# Altium schematic sheet GSM.SchDoc
size A2; SheetNumber: 3; SheetTotal: 8
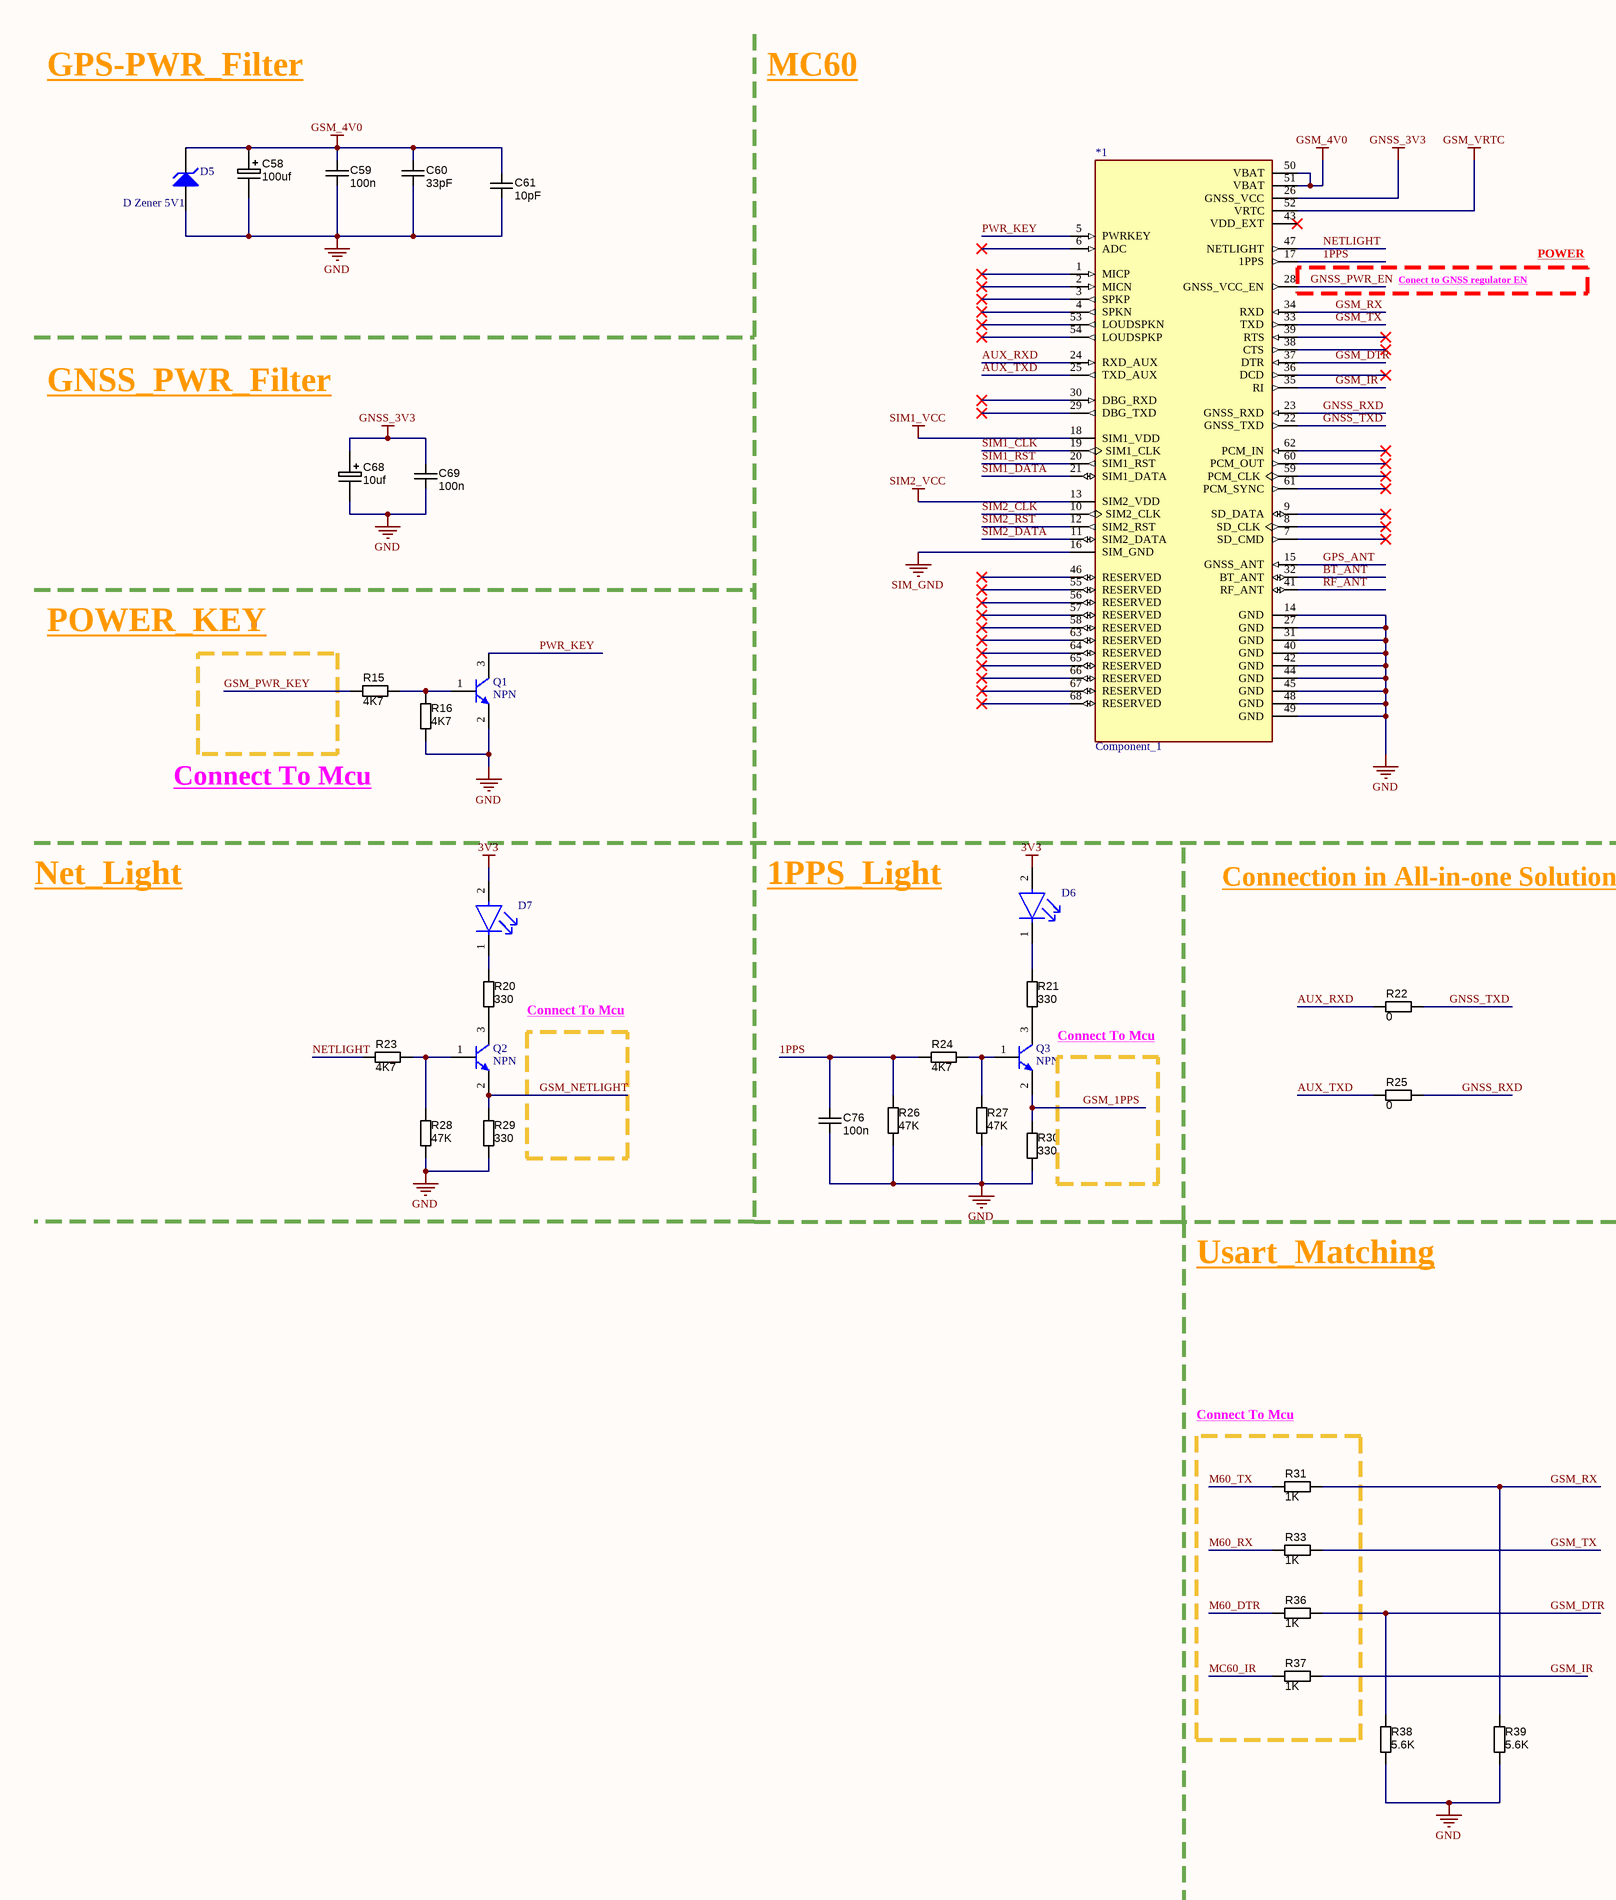
[diagram p0: GSM.SchDoc, left]
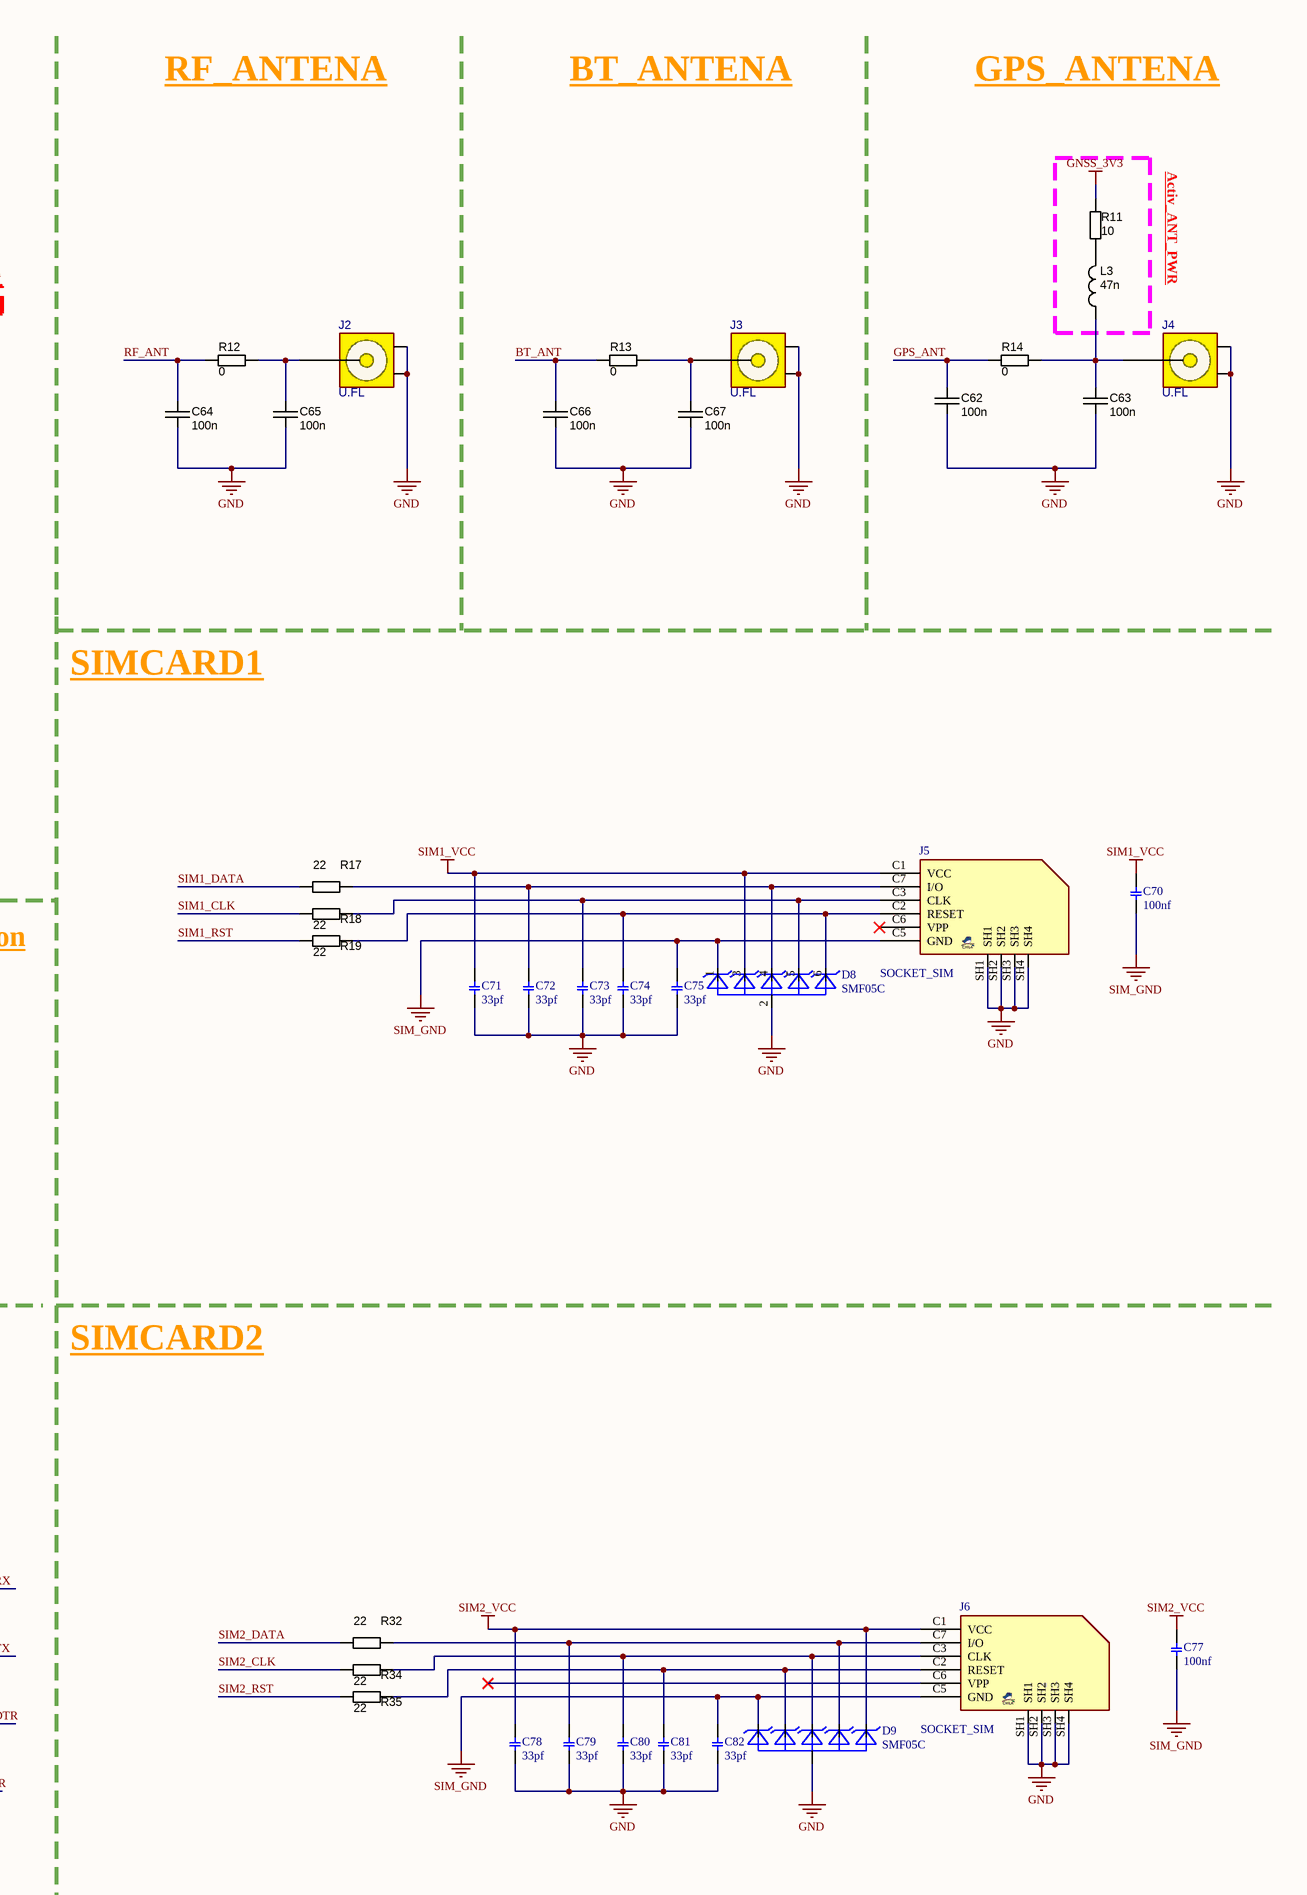
[diagram p1: GSM.SchDoc, right]

## Parts
*1  Component_1  [PCBComponent_1]
C58  value 100uf  [C_TN_3528]
C59  value 100n  [CAPC1608X90N]  (hidden comment: approved sub OK)
C60  value 33pF  [CAPC1608X90N]  (hidden comment: approved sub OK)
C61  value 10pF  [CAPC1608X90N]  (hidden comment: approved sub OK)
C62  value 100n  [C0402]  (hidden comment: approved sub OK)
C63  value 100n  [C0402]  (hidden comment: approved sub OK)
C64  value 100n  [C0402]  (hidden comment: approved sub OK)
C65  value 100n  [C0402]  (hidden comment: approved sub OK)
C66  value 100n  [C0402]  (hidden comment: approved sub OK)
C67  value 100n  [C0402]  (hidden comment: approved sub OK)
C68  value 10uf  [C_TN_3528]
C69  value 100n  [CAPC1608X90N]  (hidden comment: approved sub OK)
C70  value 100nf  [0603]  (hidden comment: Capacitor C SMD 0603)
C71  value 33pf  [0603]  (hidden comment: Capacitor C SMD 0603)
C72  value 33pf  [0603]  (hidden comment: Capacitor C SMD 0603)
C73  value 33pf  [0603]  (hidden comment: Capacitor C SMD 0603)
C74  value 33pf  [0603]  (hidden comment: Capacitor C SMD 0603)
C75  value 33pf  [0603]  (hidden comment: Capacitor C SMD 0603)
C76  value 100n  [CAPC1608X90N]  (hidden comment: approved sub OK)
C77  value 100nf  [0603]  (hidden comment: Capacitor C SMD 0603)
C78  value 33pf  [0603]  (hidden comment: Capacitor C SMD 0603)
C79  value 33pf  [0603]  (hidden comment: Capacitor C SMD 0603)
C80  value 33pf  [0603]  (hidden comment: Capacitor C SMD 0603)
C81  value 33pf  [0603]  (hidden comment: Capacitor C SMD 0603)
C82  value 33pf  [0603]  (hidden comment: Capacitor C SMD 0603)
D5  D Zener 5V1  [DIODE-0.7]
D6  LTST-C191TBKT  [FP-LTST-C191TBKT-MFG]  (value not drawn)
D7  LTST-C191TBKT  [FP-LTST-C191TBKT-MFG]  (value not drawn)
D8  SMF05C  [SC70-6]
D9  SMF05C  [SC70-6]
J2  U.FL  [UFL]
J3  U.FL  [UFL]
J4  U.FL  [UFL]
J5  SOCKET_SIM  [SIM_MICRO_GCT]
J6  SOCKET_SIM  [SIM_MICRO_GCT]
L3  47n  [L0603]
Q1  NPN  [SOT23-3]
Q2  NPN  [SOT23-3]
Q3  NPN  [SOT23-3]
R11  value 10  [0402]  (hidden comment: Thick Film)
R12  value 0  [0402]  (hidden comment: Thick Film)
R13  value 0  [0402]  (hidden comment: Thick Film)
R14  value 0  [0402]  (hidden comment: Thick Film)
R15  value 4K7  [RESC1608X55N]  (hidden comment: Thick Film)
R16  value 4K7  [RESC1608X55N]  (hidden comment: Thick Film)
R17  value 22  [RESC1608X55N]  (hidden comment: Thick Film)
R18  value 22  [RESC1608X55N]  (hidden comment: Thick Film)
R19  value 22  [RESC1608X55N]  (hidden comment: Thick Film)
R20  value 330  [RESC1608X55N]  (hidden comment: Thick Film)
R21  value 330  [RESC1608X55N]  (hidden comment: Thick Film)
R22  value 0  [RESC1608X55N]  (hidden comment: Thick Film)
R23  value 4K7  [RESC1608X55N]  (hidden comment: Thick Film)
R24  value 4K7  [RESC1608X55N]  (hidden comment: Thick Film)
R25  value 0  [RESC1608X55N]  (hidden comment: Thick Film)
R26  value 47K  [RESC1608X55N]  (hidden comment: Thick Film)
R27  value 47K  [RESC1608X55N]  (hidden comment: Thick Film)
R28  value 47K  [RESC1608X55N]  (hidden comment: Thick Film)
R29  value 330  [RESC1608X55N]  (hidden comment: Thick Film)
R30  value 330  [RESC1608X55N]  (hidden comment: Thick Film)
R31  value 1K  [RESC1608X55N]  (hidden comment: Thick Film)
R32  value 22  [RESC1608X55N]  (hidden comment: Thick Film)
R33  value 1K  [RESC1608X55N]  (hidden comment: Thick Film)
R34  value 22  [RESC1608X55N]  (hidden comment: Thick Film)
R35  value 22  [RESC1608X55N]  (hidden comment: Thick Film)
R36  value 1K  [RESC1608X55N]  (hidden comment: Thick Film)
R37  value 1K  [RESC1608X55N]  (hidden comment: Thick Film)
R38  value 5.6K  [RESC1608X55N]  (hidden comment: Thick Film)
R39  value 5.6K  [RESC1608X55N]  (hidden comment: Thick Film)

## Blocks framed on the sheet
Connect To Mcu: R31 R33 R36 R37

## Nets
3V3: D6.2(A) D7.2(A)
GND: *1.14(GND) *1.27(GND) *1.31(GND) *1.40(GND) *1.42(GND) *1.44(GND) *1.45(GND) *1.48(GND) *1.49(GND) C58.2 C59.2 C60.2 C61.2 C62.2 C63.2 C64.2 C65.2 C66.2 C67.2 C68.2 C69.2 C71.1 C72.1 C73.1 C74.1 C75.1 C76.2 C78.1 C79.1 C80.1 C81.1 C82.1 D5.1(A) D8.2(A) D9.2(A) J2.2(G1) J2.3(G2) J3.2(G1) J3.3(G2) J4.2(G1) J4.3(G2) J5.SH1 J5.SH2 J5.SH3 J5.SH4 J6.SH1 J6.SH2 J6.SH3 J6.SH4 Q1.2(E) R16.2 R26.2 R27.2 R28.2 R29.2 R30.2 R38.2 R39.2
GNSS_3V3: *1.26(GNSS_VCC) C68.1 C69.1 R11.1
GSM_4V0: *1.50(VBAT) *1.51(VBAT) C58.1 C59.1 C60.1 C61.1 D5.2(K)
GSM_VRTC: *1.52(VRTC)
SIM1_VCC: *1.18(SIM1_VDD) C70.2 C71.2 D8.3(C2) J5.C1(VCC)
SIM2_VCC: *1.13(SIM2_VDD) C77.2 C78.2 D9.6(C5) J6.C1(VCC)
SIM_GND: *1.16(SIM_GND) C70.1 C75.2 C77.1 C82.2 D8.1(C1) D9.1(C1) J5.C5(GND) J6.C5(GND)
1PPS: *1.17(1PPS) C76.1 R24.1 R26.1
AUX_RXD: *1.24(RXD_AUX) R22.2
AUX_TXD: *1.25(TXD_AUX) R25.2
BT_ANT: *1.32(BT_ANT) C66.1 R13.2
GNSS_PWR_EN: *1.28(GNSS_VCC_EN)
GNSS_RXD: *1.23(GNSS_RXD) R25.1
GNSS_TXD: *1.22(GNSS_TXD) R22.1
GPS_ANT: *1.15(GNSS_ANT) C62.1 R14.2
GSM_1PPS: Q3.2(E) R30.1
GSM_DTR: *1.37(DTR) R36.1 R38.1
GSM_IR: *1.35(RI) R37.1
GSM_NETLIGHT: Q2.2(E) R29.1
GSM_PWR_KEY: R15.2
GSM_RX: *1.34(RXD) R31.1 R39.1
GSM_TX: *1.33(TXD) R33.1
M60_DTR: R36.2
M60_RX: R33.2
M60_TX: R31.2
MC60_IR: R37.2
NETLIGHT: *1.47(NETLIGHT) R23.1
PWR_KEY: *1.5(PWRKEY) Q1.3(C)
RF_ANT: *1.41(RF_ANT) C64.1 R12.2
SIM1_CLK: *1.19(SIM1_CLK) R18.1
SIM1_DATA: *1.21(SIM1_DATA) R17.1
SIM1_RST: *1.20(SIM1_RST) R19.1
SIM2_CLK: *1.10(SIM2_CLK) R34.1
SIM2_DATA: *1.11(SIM2_DATA) R32.1
SIM2_RST: *1.12(SIM2_RST) R35.1
NetC63_1: C63.1 J4.1(SIG) L3.1 R14.1
NetC65_1: C65.1 J2.1(SIG) R12.1
NetC67_1: C67.1 J3.1(SIG) R13.1
NetC72_2: C72.2 D8.4(C3) J5.C7(I/O) R17.2
NetC73_2: C73.2 D8.5(C4) J5.C3(CLK) R18.2
NetC74_2: C74.2 D8.6(C5) J5.C2(RESET) R19.2
NetC79_2: C79.2 D9.5(C4) J6.C7(I/O) R32.2
NetC80_2: C80.2 D9.4(C3) J6.C3(CLK) R34.2
NetC81_2: C81.2 D9.3(C2) J6.C2(RESET) R35.2
NetD6_1: D6.1(C) R21.1
NetD7_1: D7.1(C) R20.1
NetL3_2: L3.2 R11.2
NetQ1_1: Q1.1(B) R15.1 R16.1
NetQ2_1: Q2.1(B) R23.2 R28.1
NetQ2_3: Q2.3(C) R20.2
NetQ3_1: Q3.1(B) R24.2 R27.1
NetQ3_3: Q3.3(C) R21.2

Not connected (* = marked no-connect by the designer): *1 1(MICP)* 2(MICN)* 3(SPKP)* 4(SPKN)* 6(ADC)* 7(SD_CMD)* 8(SD_CLK)* 9(SD_DATA)* 29(DBG_TXD)* 30(DBG_RXD)* 36(DCD)* 38(CTS)* 39(RTS)* 43(VDD_EXT)* 46(RESERVED)* 53(LOUDSPKN)* 54(LOUDSPKP)* 55(RESERVED)* 56(RESERVED)* 57(RESERVED)* 58(RESERVED)* 59(PCM_CLK)* 60(PCM_OUT)* 61(PCM_SYNC)* 62(PCM_IN)* 63(RESERVED)* 64(RESERVED)* 65(RESERVED)* 66(RESERVED)* 67(RESERVED)* 68(RESERVED)*; J5 C6(VPP)*; J6 C6(VPP)*

## Notes on the sheet
- GPS-PWR_Filter
- MC60
- RF_ANTENA
- BT_ANTENA
- GPS_ANTENA
- Activ_ANT_PWR
- Conect to GNSS regulator EN
- POWER
- GNSS_PWR_Filter
- POWER_KEY
- SIMCARD1
- Connect To Mcu
- Net_Light
- 1PPS_Light
- Connection in All-in-one Solution
- Usart_Matching
- SIMCARD2
- Title:
- Serial Number:
- Author:
- Revision:
- AmirMahdiHasanzadeh
- 4LB_V1.0.0
- Sheet       of
- Drawn By:
- Sheet Size: A2
- 3
- AmirMAhdiHasanzadeh
- File:
- Approved By:
- Date:
- 2021/11/08

## Library data of the parts
C58 = CAPT_4u7_3216_16V: Capacitor SMD Tantalum 100uF 10% 16V 3216-18; Manufacturer 1: Vishay/Sprague; Manufacturer Part Number 1: 293D475X9016A2TE3; SCDType: undef; Package / Case: EIA 535BAAC size A; Ratings: 16V; Tolerance: ±10%; Material: Tantalum; Supplier 1: Digi-Key; Supplier Part Number 1: 718-1148-1-ND
C59 C62-C67 C69 C76 = CAPC_100n_0603_X7R_50V_10%: Capacitor SMD Cer 100nF 10% 50V X7R 0603; Manufacturer 1: AVX Corporation; Manufacturer Part Number 1: 06035C104KAT2A; Ratings: 50V; X7R; Material: ceramic; SCDType: spec; Manufacturer 2: TDK Corporation; Manufacturer Part Number 2: C1608X7R1H104K; Package / Case: 0603 (1608 Metric); Tolerance: ±10%; Supplier 1: Digi-Key; Supplier Part Number 1: 478-5052-1-ND; ComponentLink1URL: http://www.avx.com/docs/Catalogs/cx7r.pdf; ComponentLink1Description: http://www.avx.com/docs/Catalogs/cx7r.pdf; Supplier 2: Digi-Key; Supplier Part Number 2: 445-1314-1-ND; ComponentLink2URL: http://product.tdk.com/capacitor/mlcc/en/documents/mlcc_commercial_general_en.pdf; ComponentLink2Description: http://product.tdk.com/capacitor/mlcc/en/documents/mlcc_commercial_general_en.pdf
C60 = CAPC_100n_0603_X7R_50V_10%: Capacitor SMD Cer 33pF10% 50V X7R 0603; Manufacturer 1: AVX Corporation; Manufacturer Part Number 1: 06035C104KAT2A; Tolerance: ±10%; Ratings: 50V; X7R; Material: ceramic; SCDType: spec; Manufacturer 2: TDK Corporation; Manufacturer Part Number 2: C1608X7R1H104K; Package / Case: 0603 (1608 Metric); Supplier 1: Digi-Key; Supplier Part Number 1: 478-5052-1-ND; ComponentLink1URL: http://www.avx.com/docs/Catalogs/cx7r.pdf; ComponentLink1Description: http://www.avx.com/docs/Catalogs/cx7r.pdf; Supplier 2: Digi-Key; Supplier Part Number 2: 445-1314-1-ND; ComponentLink2URL: http://product.tdk.com/capacitor/mlcc/en/documents/mlcc_commercial_general_en.pdf; ComponentLink2Description: http://product.tdk.com/capacitor/mlcc/en/documents/mlcc_commercial_general_en.pdf
C61 = CAPC_100n_0603_X7R_50V_10%: Capacitor SMD Cer 10pF10% 50V X7R 0603; Manufacturer 1: AVX Corporation; Manufacturer Part Number 1: 06035C104KAT2A; Tolerance: ±10%; Ratings: 50V; X7R; Material: ceramic; SCDType: spec; Manufacturer 2: TDK Corporation; Manufacturer Part Number 2: C1608X7R1H104K; Package / Case: 0603 (1608 Metric); Supplier 1: Digi-Key; Supplier Part Number 1: 478-5052-1-ND; ComponentLink1URL: http://www.avx.com/docs/Catalogs/cx7r.pdf; ComponentLink1Description: http://www.avx.com/docs/Catalogs/cx7r.pdf; Supplier 2: Digi-Key; Supplier Part Number 2: 445-1314-1-ND; ComponentLink2URL: http://product.tdk.com/capacitor/mlcc/en/documents/mlcc_commercial_general_en.pdf; ComponentLink2Description: http://product.tdk.com/capacitor/mlcc/en/documents/mlcc_commercial_general_en.pdf
C68 = CAPT_4u7_3216_16V: Capacitor SMD Tantalum 10uF 10% 16V 3216-18; Manufacturer 1: Vishay/Sprague; Manufacturer Part Number 1: 293D475X9016A2TE3; SCDType: undef; Package / Case: EIA 535BAAC size A; Ratings: 16V; Tolerance: ±10%; Material: Tantalum; Supplier 1: Digi-Key; Supplier Part Number 1: 718-1148-1-ND
D5 = D Zener: Zener Diode; Published: 8-Jun-2000; LatestRevisionDate: 17-Jul-2002; LatestRevisionNote: Re-released for DXP Platform.; PackageReference: DIODE-0.7; Publisher: Altium Limited; PackageDescription: Diode, Thru-Hole; 2 Leads; 0.7 in Pin Spacing
D6 D7 = CMP-22017-000008-1: LED BLUE CLEAR CHIP SMD; Lens Color: Colorless; Dominant Wavelength: 475nm; Forward Current: 20mA; Wavelength: 468nm; Viewing Angle: 130°; Power Dissipation: 76mW; Luminous Intensity: 180mcd; Reverse Voltage: 5V; Number of Elements: 1; Lens Style: Diffused; Forward Voltage: 3.8V; Max Power Dissipation: 75mW; Case Code (Metric): 1608; Packaging: Tape and Reel; Case/Package: 0603; Depth: 1.6mm; Mount: Surface Mount; Lead Free: Lead Free; Min Operating Temperature: -20°C; Lens Transparency: Clear; Illumination Color: Blue; Height: 0.55mm; Test Current: 20mA; Case Code (Imperial): 0603; Max Operating Temperature: 80°C; Number of Pins: 2; Length: 0.8mm; Radiation Hardening: No; Package Quantity: 1; Number of LEDs: 1; Width: 0.8mm; Color: Blue
D8 D9 = SMF05C: 12.5V Clamp 8A _8/20Âµs_ Ipp Tvs Diode Surface Mount SC-88/SC70-6/SOT-363; MF: ON Semiconductor; Availability: Unavailable; Price: None; Package: SOT-363 ON Semiconductor; Value: *; SnapEDA_Link: https://www.snapeda.com/parts/SMF05C/ON%20Semiconductor/view-part/2782704/?ref=snap; MP: SMF05C
J2-J4 = CONN_RF_UFL: CONN, RF, U.FL, STRAIGHT, Ultra Miniature Coaxial; MANF_P#: CONUFL001-SMD, U.FL-R-SMT-1(10), 128-0711-201; MANF: Linx, Hirose, Cinch; PARAM: 50Ohm, 6GHz; DESC: DESCRIPTION; DIST#: DIGIKEY, MOUSER; PARAM2: GOLD; ASSEMBLY: ASSEMBLY; PRICE: 0.9$; VALUE: U.FL
J5 J6 = SIM_MICRO_6: SOCKET, SIM MICRO; MANF: -; PRICE: 3t@Lion Iran; MANF_P#: -; DESC: -; VALUE: SOCKET_SIM
L3 = INDC_10u_LowRDC: Inductor SMD Low DCR 47 nH 900mA 20% 1210; Manufacturer 1: Taiyo Yuden; Manufacturer Part Number 1: CBC3225T100MR; Ratings: 900 mA; 133 mOhm; DC Resistance (DCR): 172.9 mOhm Max; Frequency - Self Resonant: 23MHz; Frequency - Test: 100kHz; SCDType: spec; Tolerance: ±20%; Supplier 1: Digi-Key; Supplier Part Number 1: 587-1625-1-ND; Current: 900mA; Current - Saturation: 900mA; Current - Temperature Rise: 900mA; Applications: Power Supplies; Package / Case: 1210 (3225 Metric); Operating Temperature: -40°C ~ 105°C; ComponentLink1URL: http://www.yuden.co.jp/ut/product/pdf/wound02_e.pdf; ComponentLink1Description: http://www.yuden.co.jp/ut/product/pdf/wound02_e.pdf; Value: 47n
Q1-Q3 = NPN: NPN Bipolar Transistor; Published: 8-Jun-2000; LatestRevisionDate: 17-Jul-2002; LatestRevisionNote: Re-released for DXP Platform.; PackageReference: TO-226-AA; Publisher: Altium Limited; PackageDescription: TO, Flat Index; 3 In-Line, Axial Leads; Body Dia. 4.8mm; Leads 0.55 x 0.51 mm (max); Code_JEDEC: TO-226-AA
R11 = RES_4K7_0603_5%: Resistor SMD chip 10 Ohm 0.1W 5% 0603; Manufacturer 1: Vishay/Dale; Manufacturer Part Number 1: CRCW06034K70JNEA; Ratings: 1/10 W; SCDType: spec; Package / Case: 0603 (1608 metric); Tolerance: ±5%; Material: Thick Film; Supplier 1: Digi-Key; Supplier Part Number 1: 541-4.7KGCT-ND
R12-R14 R22 R25 = RES_4K7_0603_5%: Resistor SMD chip 0 Ohm 0.1W 5% 0603; Manufacturer 1: Vishay/Dale; Manufacturer Part Number 1: CRCW06034K70JNEA; Ratings: 1/10 W; SCDType: spec; Package / Case: 0603 (1608 metric); Tolerance: ±5%; Material: Thick Film; Supplier 1: Digi-Key; Supplier Part Number 1: 541-4.7KGCT-ND
R15 R16 R23 R24 = RES_4K7_0603_5%: Resistor SMD chip 4.7k Ohm 0.1W 5% 0603; Manufacturer 1: Vishay/Dale; Manufacturer Part Number 1: CRCW06034K70JNEA; Ratings: 1/10 W; SCDType: spec; Package / Case: 0603 (1608 metric); Tolerance: ±5%; Material: Thick Film; Supplier 1: Digi-Key; Supplier Part Number 1: 541-4.7KGCT-ND
R17-R19 R32 R34 R35 = RES_4K7_0603_5%: Resistor SMD chip 22 Ohm 0.1W 5% 0603; Manufacturer 1: Vishay/Dale; Manufacturer Part Number 1: CRCW06034K70JNEA; Ratings: 1/10 W; SCDType: spec; Package / Case: 0603 (1608 metric); Tolerance: ±5%; Material: Thick Film; Supplier 1: Digi-Key; Supplier Part Number 1: 541-4.7KGCT-ND
R20 R21 R29 R30 = RES_4K7_0603_5%: Resistor SMD chip 330 Ohm 0.1W 5% 0603; Manufacturer 1: Vishay/Dale; Manufacturer Part Number 1: CRCW06034K70JNEA; Ratings: 1/10 W; SCDType: spec; Package / Case: 0603 (1608 metric); Tolerance: ±5%; Material: Thick Film; Supplier 1: Digi-Key; Supplier Part Number 1: 541-4.7KGCT-ND
R26-R28 = RES_4K7_0603_5%: Resistor SMD chip 47K Ohm 0.1W 5% 0603; Manufacturer 1: Vishay/Dale; Manufacturer Part Number 1: CRCW06034K70JNEA; Ratings: 1/10 W; SCDType: spec; Package / Case: 0603 (1608 metric); Tolerance: ±5%; Material: Thick Film; Supplier 1: Digi-Key; Supplier Part Number 1: 541-4.7KGCT-ND
R31 R33 R36 R37 = RES_4K7_0603_5%: Resistor SMD chip 1K Ohm 0.1W 5% 0603; Manufacturer 1: Vishay/Dale; Manufacturer Part Number 1: CRCW06034K70JNEA; Ratings: 1/10 W; SCDType: spec; Package / Case: 0603 (1608 metric); Tolerance: ±5%; Material: Thick Film; Supplier 1: Digi-Key; Supplier Part Number 1: 541-4.7KGCT-ND
R38 R39 = RES_4K7_0603_5%: Resistor SMD chip 5.6K Ohm 0.1W 5% 0603; Manufacturer 1: Vishay/Dale; Manufacturer Part Number 1: CRCW06034K70JNEA; Ratings: 1/10 W; SCDType: spec; Package / Case: 0603 (1608 metric); Tolerance: ±5%; Material: Thick Film; Supplier 1: Digi-Key; Supplier Part Number 1: 541-4.7KGCT-ND
C70-C75 C77-C82 = Capacitor C SMD 0603: DatasheetVersion: 2021; ComponentLink1Description: Website Smart World; ComponentLink1URL: https://www.smartw.ir/; ComponentLink2Description: Telegram; ComponentLink2URL: https://t.me/altium_smartw; ComponentLink3Description: Instagram; ComponentLink3URL: https://Instagram.com/smartgw.ir